# Altium project Base_station_Unit_board.PrjPcb
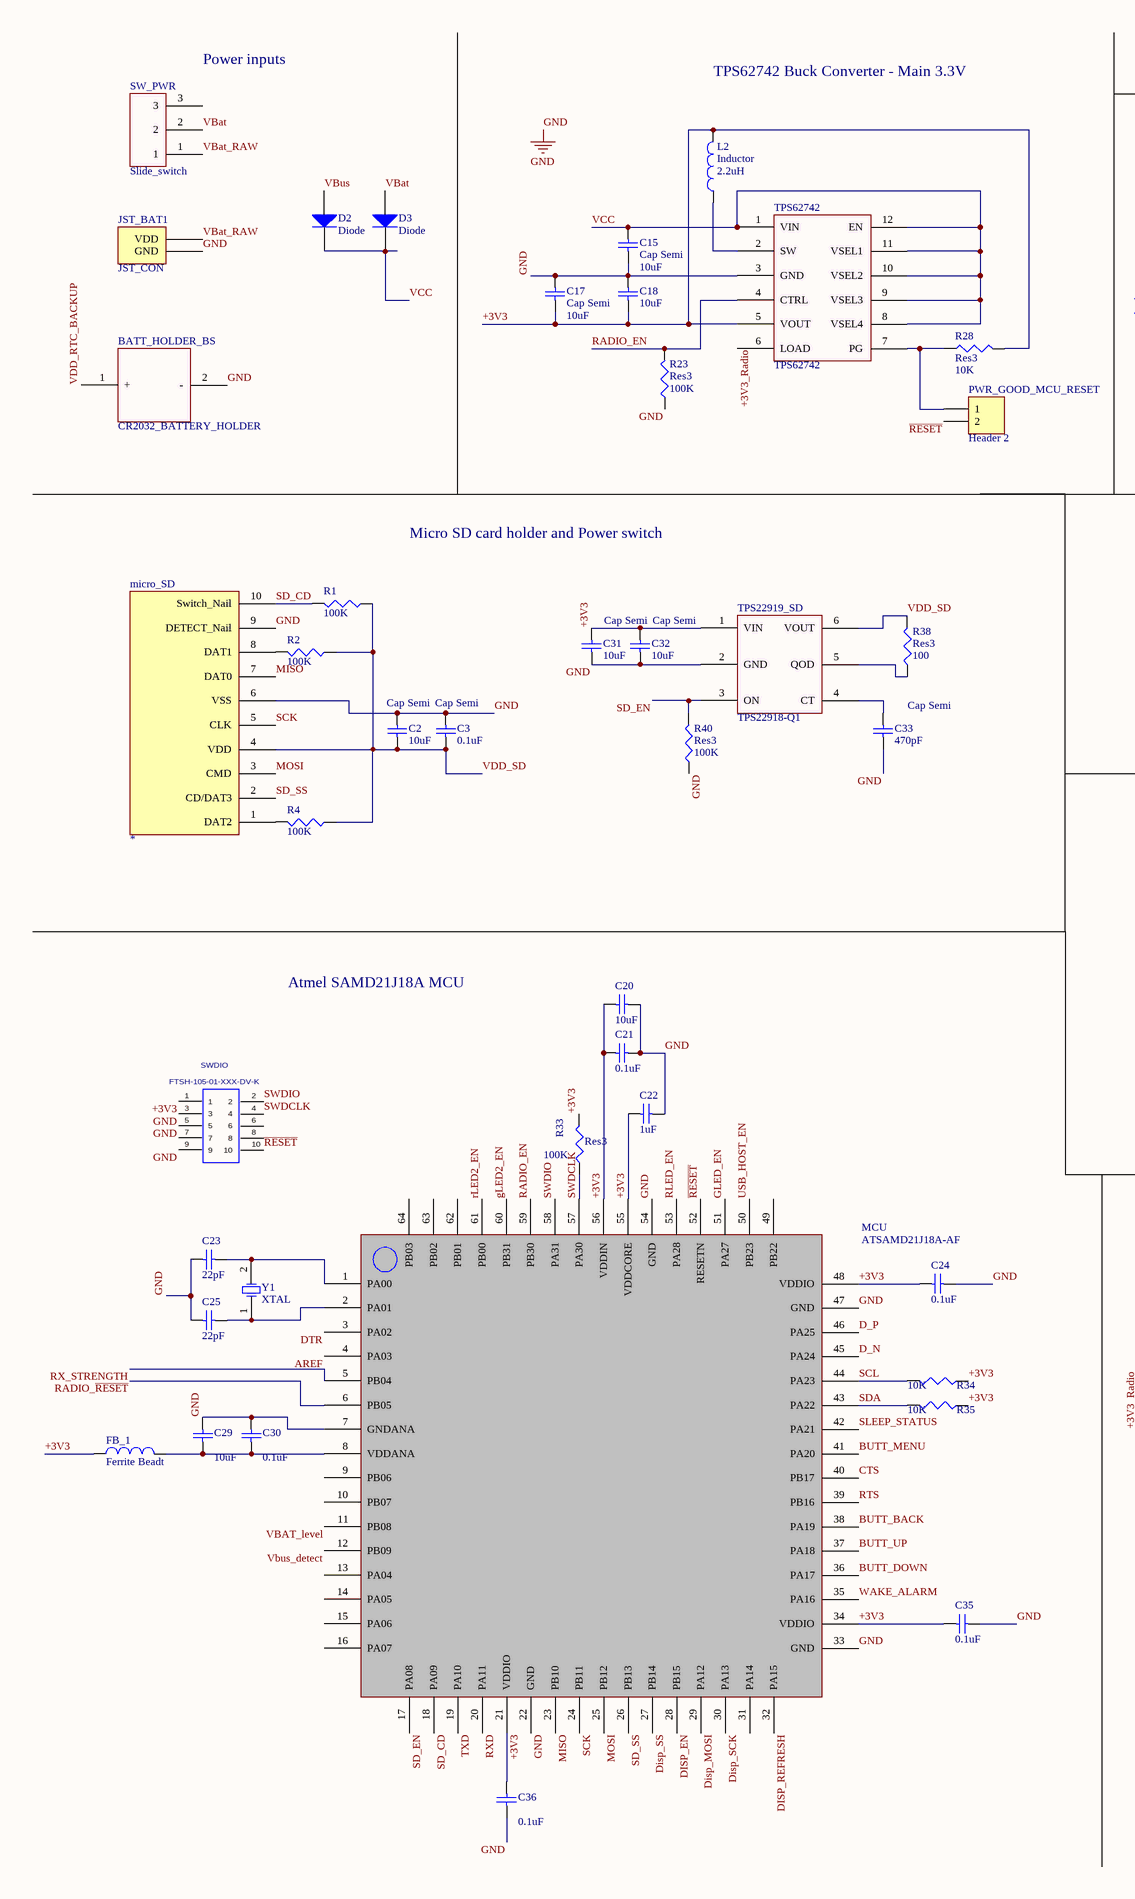
[diagram p0: Base_station_Unit_board.SchDoc, left]
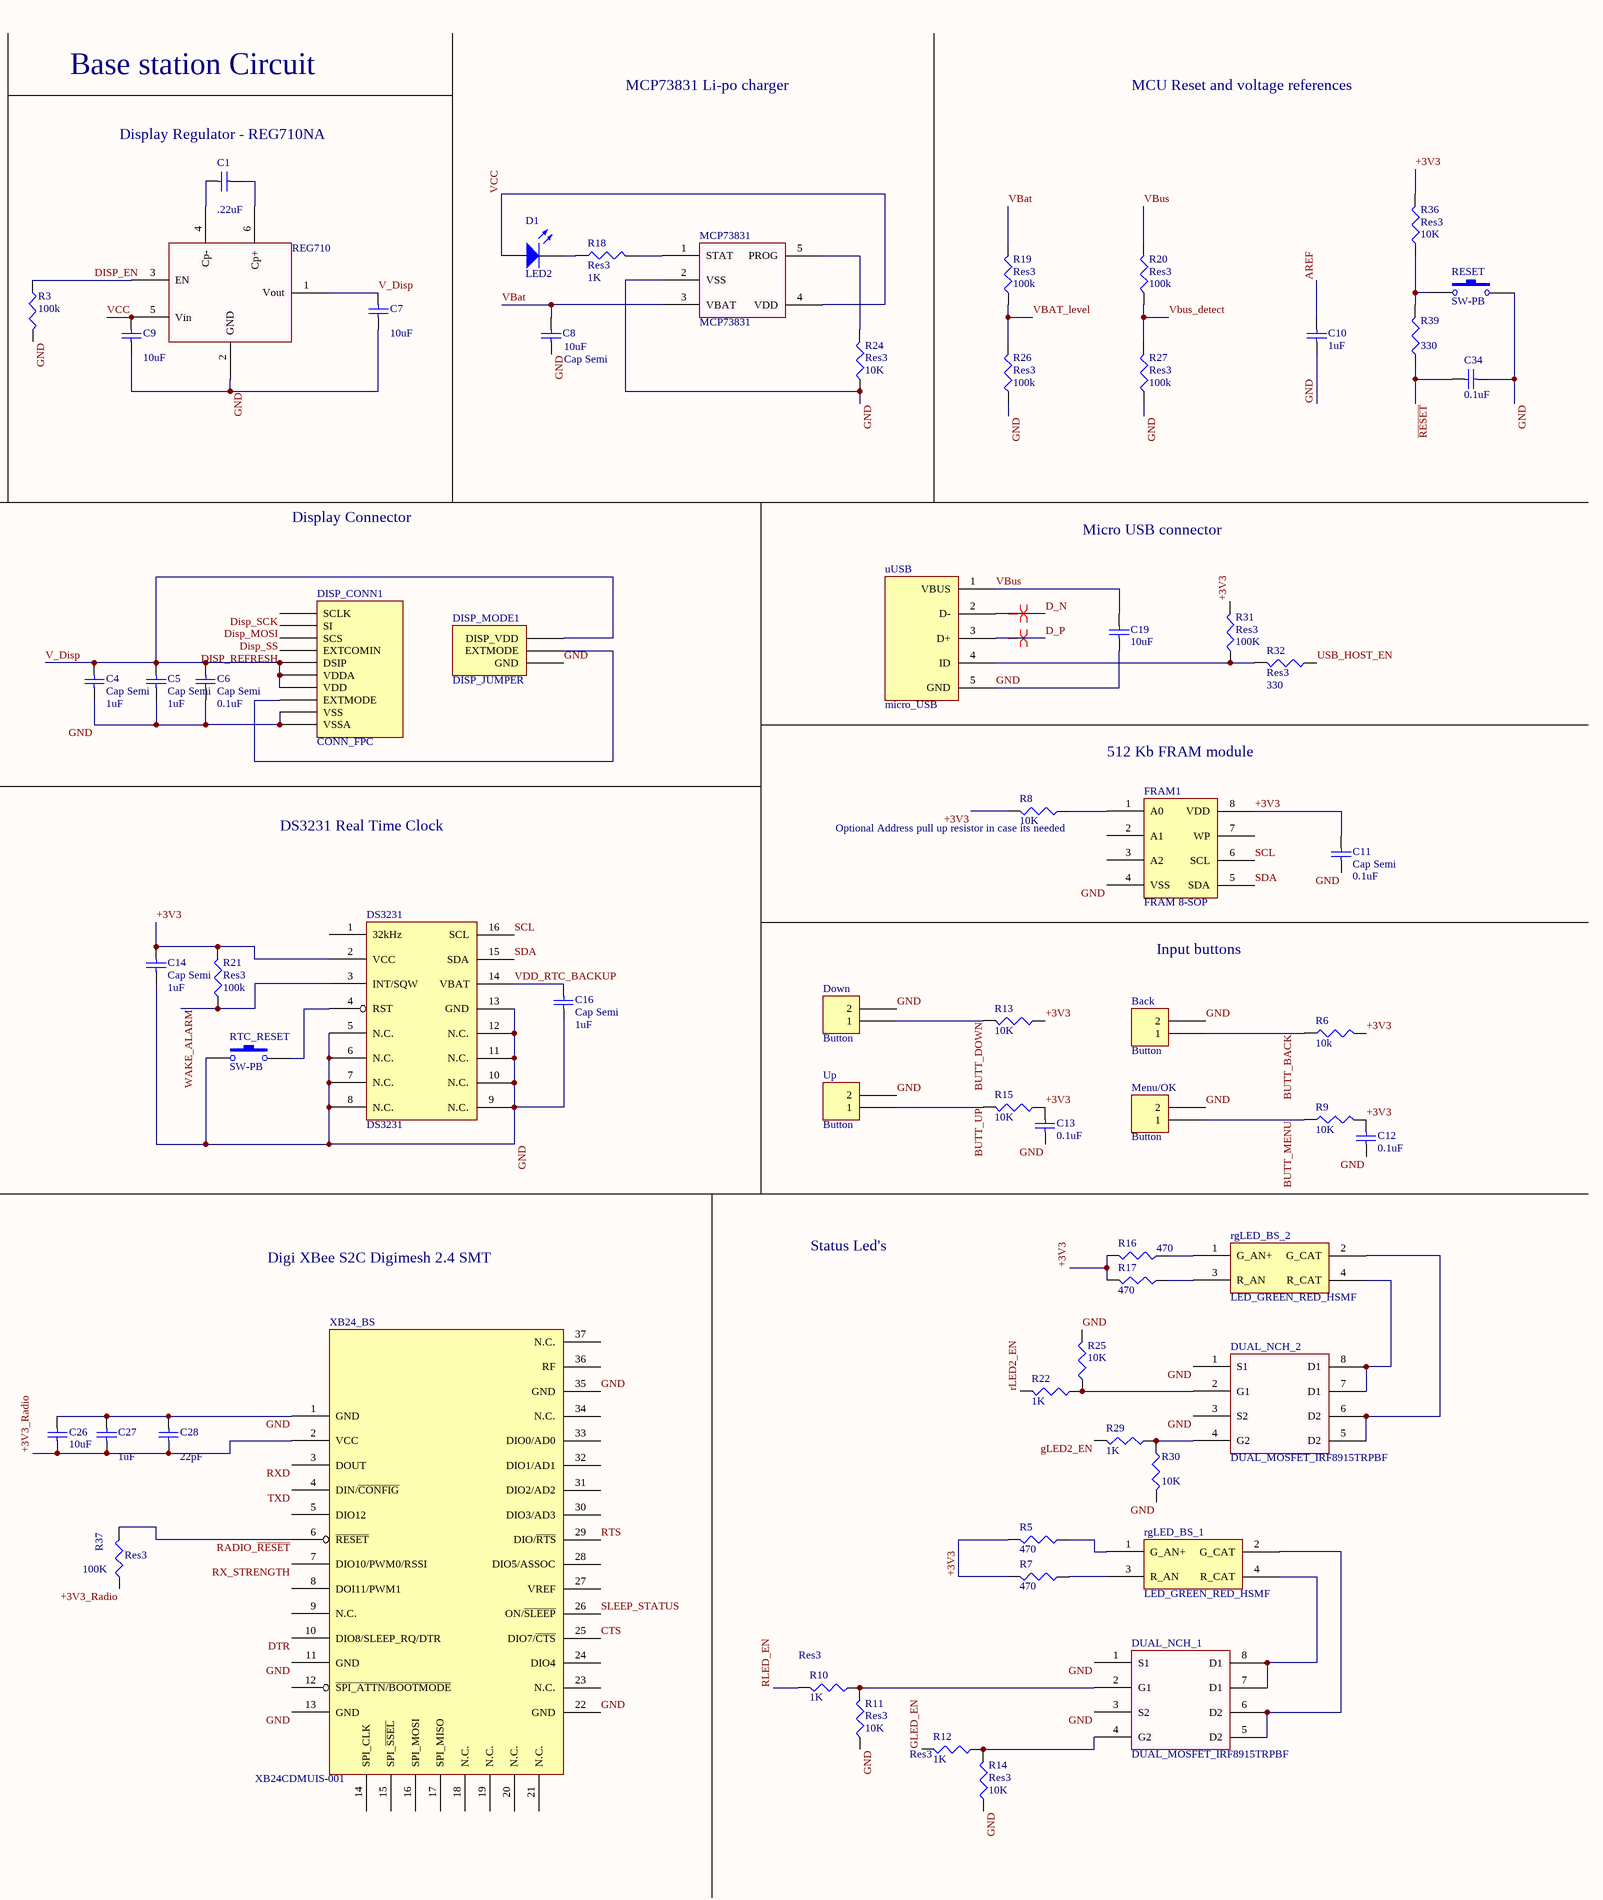
[diagram p1: Base_station_Unit_board.SchDoc, right]
1 sheet, 109 parts. Net scope: global (net labels, ports and power ports of the same name join across sheets).
Board file: Base_Station_Unit_board.PcbDoc

## Sheet Base_station_Unit_board.SchDoc
size A2

### Parts
Back  Button  [EVPASCB1A - Tactile Switch]
BATT_HOLDER_BS  CR2032_BATTERY_HOLDER  [CR1220_clip]
C1  value .22uF  [C0805]  (hidden comment: Cap Semi)
C2  Cap Semi  value 10uF  [1608[0603]]
C3  Cap Semi  value 0.1uF  [C0805]
C4  Cap Semi  value 1uF  [C0805]
C5  Cap Semi  value 1uF  [C0805]
C6  Cap Semi  value 0.1uF  [C0805]
C7  value 10uF  [1608[0603]]  (hidden comment: Cap Semi)
C8  Cap Semi  value 10uF  [1608[0603]]
C9  value 10uF  [1608[0603]]  (hidden comment: Cap Semi)
C10  value 1uF  [C0805]  (hidden comment: Cap Semi)
C11  Cap Semi  value 0.1uF  [C0805]
C12  value 0.1uF  [C0805]  (hidden comment: Cap Semi)
C13  value 0.1uF  [C0805]  (hidden comment: Cap Semi)
C14  Cap Semi  value 1uF  [C0805]
C15  Cap Semi  value 10uF  [1608[0603]]
C16  Cap Semi  value 1uF  [C0805]
C17  Cap Semi  value 10uF  [1608[0603]]
C18  value 10uF  [1608[0603]]  (hidden comment: Cap Semi)
C19  value 10uF  [1608[0603]]  (hidden comment: Cap Semi)
C20  value 10uF  [1608[0603]]  (hidden comment: Cap Semi)
C21  value 0.1uF  [C0805]  (hidden comment: Cap Semi)
C22  value 1uF  [C0805]  (hidden comment: Cap Semi)
C23  value 22pF  [1608[0603]]  (hidden comment: Cap Semi)
C24  value 0.1uF  [C0805]  (hidden comment: Cap Semi)
C25  value 22pF  [1608[0603]]  (hidden comment: Cap Semi)
C26  value 10uF  [1608[0603]]  (hidden comment: Cap Semi)
C27  value 1uF  [C0805]  (hidden comment: Cap Semi)
C28  value 22pF  [1608[0603]]  (hidden comment: Cap Semi)
C29  value 10uF  [1608[0603]]  (hidden comment: Cap Semi)
C30  value 0.1uF  [C0805]  (hidden comment: Cap Semi)
C31  Cap Semi  value 10uF  [C0805]
C32  Cap Semi  value 10uF  [C0805]
C33  Cap Semi  value 470pF  [C0805]
C34  value 0.1uF  [C0805]  (hidden comment: Cap Semi)
C35  value 0.1uF  [C0805]  (hidden comment: Cap Semi)
C36  value 0.1uF  [C0805]  (hidden comment: Cap Semi)
D1  LED2  [LED_Single_Orange]
D2  Diode  [DO-214AC]
D3  Diode  [DO-214AC]
DISP_CONN1  CONN_FPC  [CONN_FPC]
DISP_MODE1  DISP_JUMPER  [DISP_Jumper]
Down  Button  [EVPASCB1A - Tactile Switch]
DS3231  DS3231  [16 SO]
DUAL_NCH_1  DUAL_MOSFET_IRF8915TRPBF  [SOP-8]
DUAL_NCH_2  DUAL_MOSFET_IRF8915TRPBF  [SOP-8]
FB_1  Ferrite Beadt  [FERRITE_BEAD]
FRAM1  FRAM 8-SOP  [SOP-8]
JST_BAT1  JST_CON  [JST_CONN_SMT_Vertical]
L2  Inductor  value 2.2uH  [2.2uH_Inductor]
MCP73831  MCP73831  [SOT-23]
MCU  ATSAMD21J18A-AF  [QFN64_rect_medPin]
Menu/OK  Button  [EVPASCB1A - Tactile Switch]
micro_SD  *  [MicroSD_Connector]
PWR_GOOD_MCU_RESET  Header 2  [SMD_Jumper]
R1  value 100K  [6-0805_N]  (hidden comment: Res3)
R2  value 100K  [6-0805_N]  (hidden comment: Res3)
R3  value 100k  [6-0805_N]  (hidden comment: Res3)
R4  value 100K  [6-0805_N]  (hidden comment: Res3)
R5  value 470  [6-0805_N]  (hidden comment: Res3)
R6  value 10k  [6-0805_N]  (hidden comment: Res3)
R7  value 470  [6-0805_N]  (hidden comment: Res3)
R8  value 10K  [6-0805_N]  (hidden comment: Res3)
R9  value 10K  [6-0805_N]  (hidden comment: Res3)
R10  Res3  value 1K  [6-0805_N]
R11  Res3  value 10K  [6-0805_N]
R12  Res3  value 1K  [6-0805_N]
R13  value 10K  [6-0805_N]  (hidden comment: Res3)
R14  Res3  value 10K  [6-0805_N]
R15  value 10K  [6-0805_N]  (hidden comment: Res3)
R16  value 470  [6-0805_N]  (hidden comment: Res3)
R17  value 470  [6-0805_N]  (hidden comment: Res3)
R18  Res3  value 1K  [6-0805_N]
R19  Res3  value 100k  [6-0805_N]
R20  Res3  value 100k  [6-0805_N]
R21  Res3  value 100k  [6-0805_N]
R22  value 1K  [6-0805_N]  (hidden comment: Res3)
R23  Res3  value 100K  [6-0805_N]
R24  Res3  value 10K  [6-0805_N]
R25  value 10K  [6-0805_N]  (hidden comment: Res3)
R26  Res3  value 100k  [6-0805_N]
R27  Res3  value 100k  [6-0805_N]
R28  Res3  value 10K  [6-0805_N]
R29  value 1K  [6-0805_N]  (hidden comment: Res3)
R30  value 10K  [6-0805_N]  (hidden comment: Res3)
R31  Res3  value 100K  [6-0805_N]
R32  Res3  value 330  [6-0805_N]
R33  Res3  value 100K  [6-0805_N]
R34  value 10K  [6-0805_N]  (hidden comment: Res3)
R35  value 10K  [6-0805_N]  (hidden comment: Res3)
R36  Res3  value 10K  [6-0805_N]
R37  Res3  value 100K  [6-0805_N]
R38  Res3  value 100  [6-0805_N]
R39  value 330  [6-0805_N]  (hidden comment: Res3)
R40  Res3  value 100K  [6-0805_N]
REG710  REG710NA-5/3K  [SOT-23-6]  (value not drawn)
RESET  SW-PB  [SW_TACTILE]
rgLED_BS_1  LED_GREEN_RED_HSMF  [LED4]
rgLED_BS_2  LED_GREEN_RED_HSMF  [LED4]
RTC_RESET  SW-PB  [SW_TACTILE]
SW_PWR  Slide_switch  [Slide_SW]
SWDIO  FTSH-105-01-XXX-DV-K  [FTSH-105-01-XXX-DV-K]
TPS22919_SD  TPS22918-Q1  [SOT-23-6]
TPS62742  TPS62742  [WSON12 - small]
Up  Button  [EVPASCB1A - Tactile Switch]
uUSB  micro_USB  [MicroUSB_CONN]
XB24_BS  XB24CDMUIS-001  [XB24_RADIO]
Y1  XTAL  [ABS07_Crystal]

### Nets
GND: Back.2 BATT_HOLDER_BS.2(-) C2.2 C3.2 C4.1 C5.1 C6.1 C7.1 C8.1 C9.1 C10.2 C11.1 C12.1 C13.1 C14.1 C15.1 C16.1 C17.1 C18.2 C19.2 C20.1 C21.1 C22.1 C23.2 C24.1 C25.2 C26.1 C27.2 C28.2 C29.2 C30.2 C31.2 C32.2 C33.2 C34.1 C35.1 C36.1 DISP_CONN1.9(VSS) DISP_CONN1.10(VSSA) DISP_MODE1.1(GND) Down.2 DS3231.5(N.C.) DS3231.6(N.C.) DS3231.7(N.C.) DS3231.8(N.C.) DS3231.9(N.C.) DS3231.10(N.C.) DS3231.11(N.C.) DS3231.12(N.C.) DS3231.13(GND) DUAL_NCH_1.1(S1) DUAL_NCH_1.3(S2) DUAL_NCH_2.1(S1) DUAL_NCH_2.3(S2) FRAM1.4(VSS) JST_BAT1.1(GND) MCP73831.2(VSS) MCU.7(GNDANA) MCU.22(GND) MCU.33(GND) MCU.47(GND) MCU.54(GND) Menu/OK.2 micro_SD.6(VSS) micro_SD.9(DETECT_Nail) R3.2 R11.1 R14.1 R23.1 R24.1 R25.2 R26.1 R27.1 R30.2 R40.1 REG710.2(GND) RESET.2 RTC_RESET.1 SWDIO.3 SWDIO.5 SWDIO.9 TPS22919_SD.2(GND) TPS62742.3(GND) Up.2 uUSB.5(GND) XB24_BS.1(GND) XB24_BS.11(GND) XB24_BS.13(GND) XB24_BS.22(GND) XB24_BS.35(GND)
+3V3: C11.2 C12.2 C13.2 C14.2 C17.2 C18.1 C20.2 C21.2 C22.2 C24.2 C31.1 C32.1 C35.2 C36.2 DS3231.2(VCC) FB_1.1 FRAM1.8(VDD) L2.2 MCU.21(VDDIO) MCU.34(VDDIO) MCU.48(VDDIO) MCU.55(VDDCORE) MCU.56(VDDIN) R5.2 R6.2 R7.2 R8.2 R9.2 R13.1 R15.1 R16.2 R17.2 R21.2 R28.2 R31.2 R33.2 R34.1 R35.1 R36.2 SWDIO.1 TPS22919_SD.1(VIN) TPS62742.5(VOUT)
+3V3_Radio: C26.2 C27.1 C28.1 R37.1 TPS62742.6(LOAD) XB24_BS.2(VCC)
AREF: C10.1 MCU.4(PA03)
BUTT_BACK: Back.1 MCU.38(PA19) R6.1
BUTT_DOWN: Down.1 MCU.36(PA17) R13.2
BUTT_MENU: MCU.41(PA20) Menu/OK.1 R9.1
BUTT_UP: MCU.37(PA18) R15.2 Up.1
CTS: MCU.40(PB17) XB24_BS.25(DIO7/~{CTS})
D_N: MCU.45(PA24) uUSB.2(D-)
D_P: MCU.46(PA25) uUSB.3(D+)
DISP_EN: MCU.28(PB15) R3.1 REG710.3(EN)
Disp_MOSI: DISP_CONN1.2(SI) MCU.29(PA12)
DISP_REFRESH: DISP_CONN1.4(EXTCOMIN) MCU.32(PA15)
Disp_SCK: DISP_CONN1.1(SCLK) MCU.30(PA13)
Disp_SS: DISP_CONN1.3(SCS) MCU.27(PB14)
DTR: MCU.3(PA02) XB24_BS.10(DIO8/SLEEP_RQ/DTR)
gLED2_EN: MCU.60(PB31) R29.2
GLED_EN: MCU.51(PA27) R12.2
MISO: MCU.23(PB10) micro_SD.7(DAT0)
MOSI: MCU.25(PB12) micro_SD.3(CMD)
~{RESET}: C34.2 MCU.52(RESETN) PWR_GOOD_MCU_RESET.2 R39.1 SWDIO.10
RADIO_EN: MCU.59(PB30) R23.2 TPS62742.4(CTRL)
RADIO_~{RESET}: MCU.6(PB05) R37.2 XB24_BS.6(~{RESET})
rLED2_EN: MCU.61(PB00) R22.2
RLED_EN: MCU.53(PA28) R10.2
RTS: MCU.39(PB16) XB24_BS.29(DIO/~{RTS})
RX_STRENGTH: MCU.5(PB04) XB24_BS.7(DIO10/PWM0/RSSI)
RXD: MCU.20(PA11) XB24_BS.3(DOUT)
SCK: MCU.24(PB11) micro_SD.5(CLK)
SCL: DS3231.16(SCL) FRAM1.6(SCL) MCU.44(PA23) R34.2
SD_CD: MCU.18(PA09) micro_SD.10(Switch_Nail) R1.2
SD_EN: MCU.17(PA08) R40.2 TPS22919_SD.3(ON)
SD_SS: MCU.26(PB13) micro_SD.2(CD/DAT3)
SDA: DS3231.15(SDA) FRAM1.5(SDA) MCU.43(PA22) R35.2
SLEEP_STATUS: MCU.42(PA21) XB24_BS.26(ON/~{SLEEP})
SWDCLK: MCU.57(PA30) R33.1 SWDIO.4
SWDIO: MCU.58(PA31) SWDIO.2
TXD: MCU.19(PA10) XB24_BS.4(DIN/~{CONFIG})
USB_HOST_EN: MCU.50(PB23) R32.1
V_Disp: C4.2 C5.2 C6.2 C7.2 DISP_CONN1.5(DSIP) DISP_CONN1.6(VDDA) DISP_CONN1.7(VDD) DISP_MODE1.3(DISP_VDD) REG710.1(Vout)
VBat: C8.2 D3.1(A) MCP73831.3(VBAT) R19.2 SW_PWR.2
VBAT_level: MCU.11(PB08) R19.1 R26.2
VBat_RAW: JST_BAT1.2(VDD) SW_PWR.1
VBus: C19.1 D2.1(A) R20.2 uUSB.1(VBUS)
Vbus_detect: MCU.12(PB09) R20.1 R27.2
VCC: C9.2 C15.2 D1.1(A) D2.2(K) D3.2(K) MCP73831.4(VDD) REG710.5(Vin) TPS62742.1(VIN) TPS62742.8(VSEL4) TPS62742.9(VSEL3) TPS62742.10(VSEL2) TPS62742.11(VSEL1) TPS62742.12(EN)
VDD_RTC_BACKUP: BATT_HOLDER_BS.1(+) C16.2 DS3231.14(VBAT)
VDD_SD: C2.1 C3.1 micro_SD.4(VDD) R1.1 R2.1 R4.1 R38.2 TPS22919_SD.6(VOUT)
WAKE_ALARM: DS3231.3(INT/SQW) MCU.35(PA16) R21.1
NetC1_1: C1.1 REG710.4(Cp-)
NetC1_2: C1.2 REG710.6(Cp+)
NetC23_1: C23.1 MCU.1(PA00) Y1.2(OSC2)
NetC25_1: C25.1 MCU.2(PA01) Y1.1(OSC1)
NetC29_1: C29.1 C30.1 FB_1.2 MCU.8(VDDANA)
NetC33_1: C33.1 TPS22919_SD.4(CT)
NetD1_2: D1.2(K) R18.1
NetDISP_CONN1_8: DISP_CONN1.8(EXTMODE) DISP_MODE1.2(EXTMODE)
NetDS3231_4: DS3231.4(RST) RTC_RESET.2
NetDUAL_NCH_1_2: DUAL_NCH_1.2(G1) R10.1 R11.2
NetDUAL_NCH_1_4: DUAL_NCH_1.4(G2) R12.1 R14.2
NetDUAL_NCH_1_5: DUAL_NCH_1.5(D2) DUAL_NCH_1.6(D2) rgLED_BS_1.2(G_CAT)
NetDUAL_NCH_1_7: DUAL_NCH_1.7(D1) DUAL_NCH_1.8(D1) rgLED_BS_1.4(R_CAT)
NetDUAL_NCH_2_2: DUAL_NCH_2.2(G1) R22.1 R25.1
NetDUAL_NCH_2_4: DUAL_NCH_2.4(G2) R29.1 R30.1
NetDUAL_NCH_2_5: DUAL_NCH_2.5(D2) DUAL_NCH_2.6(D2) rgLED_BS_2.2(G_CAT)
NetDUAL_NCH_2_7: DUAL_NCH_2.7(D1) DUAL_NCH_2.8(D1) rgLED_BS_2.4(R_CAT)
NetFRAM1_1: FRAM1.1(A0) R8.1
NetL2_1: L2.1 TPS62742.2(SW)
NetMCP73831_1: MCP73831.1(STAT) R18.2
NetMCP73831_5: MCP73831.5(PROG) R24.2
Netmicro_SD_1: micro_SD.1(DAT2) R4.2
Netmicro_SD_8: micro_SD.8(DAT1) R2.2
NetPWR_GOOD_MCU_RESET_1: PWR_GOOD_MCU_RESET.1 R28.1 TPS62742.7(PG)
NetR5_1: R5.1 rgLED_BS_1.1(G_AN+)
NetR7_1: R7.1 rgLED_BS_1.3(R_AN)
NetR16_1: R16.1 rgLED_BS_2.1(G_AN+)
NetR17_1: R17.1 rgLED_BS_2.3(R_AN)
NetR31_1: R31.1 R32.2 uUSB.4(ID)
NetR36_1: R36.1 R39.2 RESET.1
NetR38_1: R38.1 TPS22919_SD.5(QOD)

Not connected (* = marked no-connect by the designer): DS3231 1(32kHz); FRAM1 2(A1) 3(A2) 7(WP); MCU 9(PB06) 10(PB07) 13(PA04) 14(PA05) 15(PA06) 16(PA07) 31(PA14) 49(PB22) 62(PB01) 63(PB02) 64(PB03); SW_PWR 3; SWDIO 6 7 8; XB24_BS 5(DIO12) 8(DOI11/PWM1) 9(N.C.) 12(~{SPI_ATTN/BOOTMODE}) 14(SPI_CLK) 15(SPI_~{SSEL}) 16(SPI_MOSI) 17(SPI_MISO) 18(N.C.) 19(N.C.) 20(N.C.) 21(N.C.) 23(N.C.) 24(DIO4) 27(VREF) 28(DIO5/ASSOC) 30(DIO3/AD3) 31(DIO2/AD2) 32(DIO1/AD1) 33(DIO0/AD0) 34(N.C.) 36(RF) 37(N.C.)

### Layout directives
differential pair: D_N, D_P

### Notes on the sheet
- Power inputs
- TPS62742 Buck Converter - Main 3.3V
- Base station Circuit
- MCP73831 Li-po charger
- MCU Reset and voltage references
- (near C1) Display Regulator - REG710NA
- Display Connector
- Micro USB connector
- Micro SD card holder and Power switch
- 512 Kb FRAM module
- DS3231 Real Time Clock
- Optional Address pull up resistor in case its needed
- Input buttons
- Atmel SAMD21J18A MCU
- Digi XBee S2C Digimesh 2.4 SMT
- Status Led's

### Library data of the parts
C1-C36 = Cap Semi: Capacitor (Semiconductor SIM Model); Published: 8-Jun-2000; LatestRevisionDate: 29-May-2009; LatestRevisionNote: IPC-7351 Footprint Added.; PackageReference: C1206; Publisher: Altium Limited; PackageDescription: Chip Capacitor
D1 = LED2: Typical RED, GREEN, YELLOW, AMBER GaAs LED; Published: 8-Jun-2000; LatestRevisionDate: 17-Jul-2002; LatestRevisionNote: Re-released for DXP Platform.; PackageVersion: Feb-2002; PackageReference: 3.2X1.6X1.1; Publisher: Altium Limited; PackageDescription: SM LED; 2 Flat Leads
D2 D3 = Diode: Default Diode; Published: 8-Jun-2000; LatestRevisionDate: 17-Jul-2002; LatestRevisionNote: Re-released for DXP Platform.; PackageVersion: Sep-1996; PackageReference: SMC; Publisher: Altium Limited; PackageDescription: DO-214-AB/SMC; 2 C-Bend Leads; Body 7.9 x 5.9 mm, inc. leads (LxW); Code_JEDEC: DO-214-AB
FB_1 = Inductor: Code_IEC: 1005; Value: 10mH; Published: 8-Jun-2000; LatestRevisionDate: 29-May-2009; LatestRevisionNote: IPC-7351 Footprint Added.; PackageReference: 0402-A; Publisher: Altium Limited; PackageDescription: Chip Inductor; Code_JEITA: 0402
L2 = Inductor: Code_IEC: 1005; Published: 8-Jun-2000; LatestRevisionDate: 29-May-2009; LatestRevisionNote: IPC-7351 Footprint Added.; PackageReference: 0402-A; Publisher: Altium Limited; PackageDescription: Chip Inductor; Code_JEITA: 0402
micro_SD = micro_SD
PWR_GOOD_MCU_RESET = Header 2: Header, 2-Pin; LatestRevisionDate: 17-Jul-2002; LatestRevisionNote: Re-released for DXP Platform.; Publisher: Altium Limited
R1-R40 = Res3: Resistor; Published: 8-Jun-2000; LatestRevisionDate: 29-May-2009; LatestRevisionNote: IPC-7351 Footprint Added.; PackageReference: J1-0603; Publisher: Altium Limited; PackageDescription: Chip Resistor
RESET RTC_RESET = SW-PB: Switch; Published: 24-Mar-1999; LatestRevisionDate: 17-Jul-2002; LatestRevisionNote: Re-released for DXP Platform.; PackageReference: SPST-2; Publisher: Altium Limited; PackageDescription: Switch; 2 Leads
SWDIO = FTSH-105-01-XXX-DV-K: TERMINAL STRIP, .050"(1.27mm) PITCH, 10 PINS, KEYED; MANUFACTURER: SAMTEC; CREATED: November 30, 2016 - Wendy Xin; PCB DECAL: FTSH-105-01-XXX-DV-K
Y1 = XTAL: Crystal Oscillator; Published: 8-Jun-2000; LatestRevisionDate: 17-Jul-2002; LatestRevisionNote: Re-released for DXP Platform.; PackageReference: R38; Publisher: Altium Limited; PackageDescription: Crystal, Thru-Hole; 2 Leads; Body 3.1 x 8.2 mm (Dia.xH)